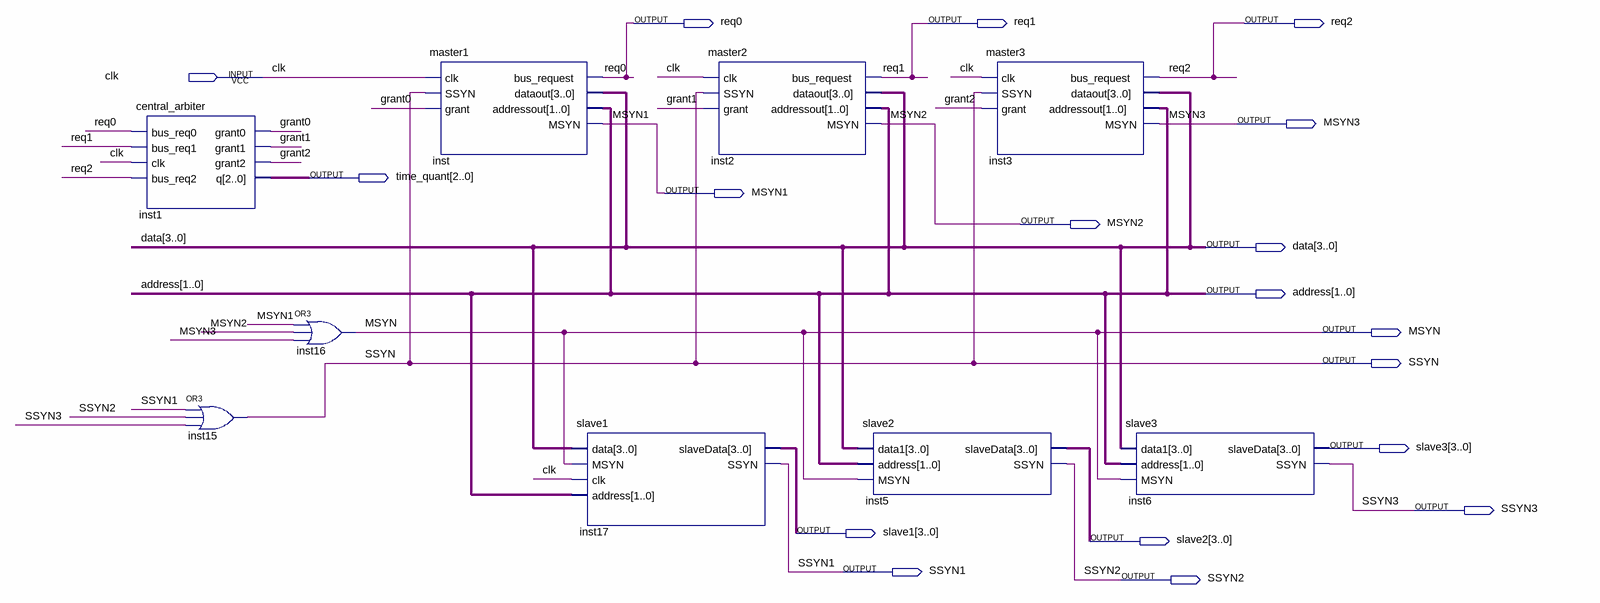
[diagram p0: schematic sheet]
// Quartus schematic main.bdf as structural Verilog: 9 symbols, 18 pins
module main (
  input  clk,
  output req0,
  output req1,
  output req2,
  output MSYN3,
  output [2:0] time_quant,
  output MSYN1,
  output MSYN2,
  output [3:0] data,
  output [1:0] address,
  output MSYN,
  output SSYN,
  output [3:0] slave3,
  output SSYN3,
  output [3:0] slave1,
  output [3:0] slave2,
  output SSYN1,
  output SSYN2
);

  wire grant0, grant1, grant2;

  central_arbiter inst1 (
    .bus_req0(req0), .bus_req1(req1), .clk(clk), .bus_req2(req2), .grant0(grant0), .grant1(grant1),
    .grant2(grant2), .q(time_quant));
  or inst15 (SSYN, SSYN1, SSYN2, SSYN3);
  or inst16 (MSYN, MSYN1, MSYN2, MSYN3);
  master1 inst (
    .clk(clk), .SSYN(SSYN), .grant(grant0), .bus_request(req0), .dataout(data), .addressout(address),
    .MSYN(MSYN1));
  slave1 inst17 (.data(data), .MSYN(MSYN), .clk(clk), .address(address), .slaveData(slave1), .SSYN(SSYN1));
  master2 inst2 (
    .clk(clk), .SSYN(SSYN), .grant(grant1), .bus_request(req1), .dataout(data), .addressout(address),
    .MSYN(MSYN2));
  slave2 inst5 (.data1(data), .address(address), .MSYN(MSYN), .slaveData(slave2), .SSYN(SSYN2));
  master3 inst3 (
    .clk(clk), .SSYN(SSYN), .grant(grant2), .bus_request(req2), .dataout(data), .addressout(address),
    .MSYN(MSYN3));
  slave3 inst6 (.data1(data), .address(address), .MSYN(MSYN), .slaveData(slave3), .SSYN(SSYN3));
endmodule
